# EAGLE design StackLightMonitor (EAGLE 8.1.0)
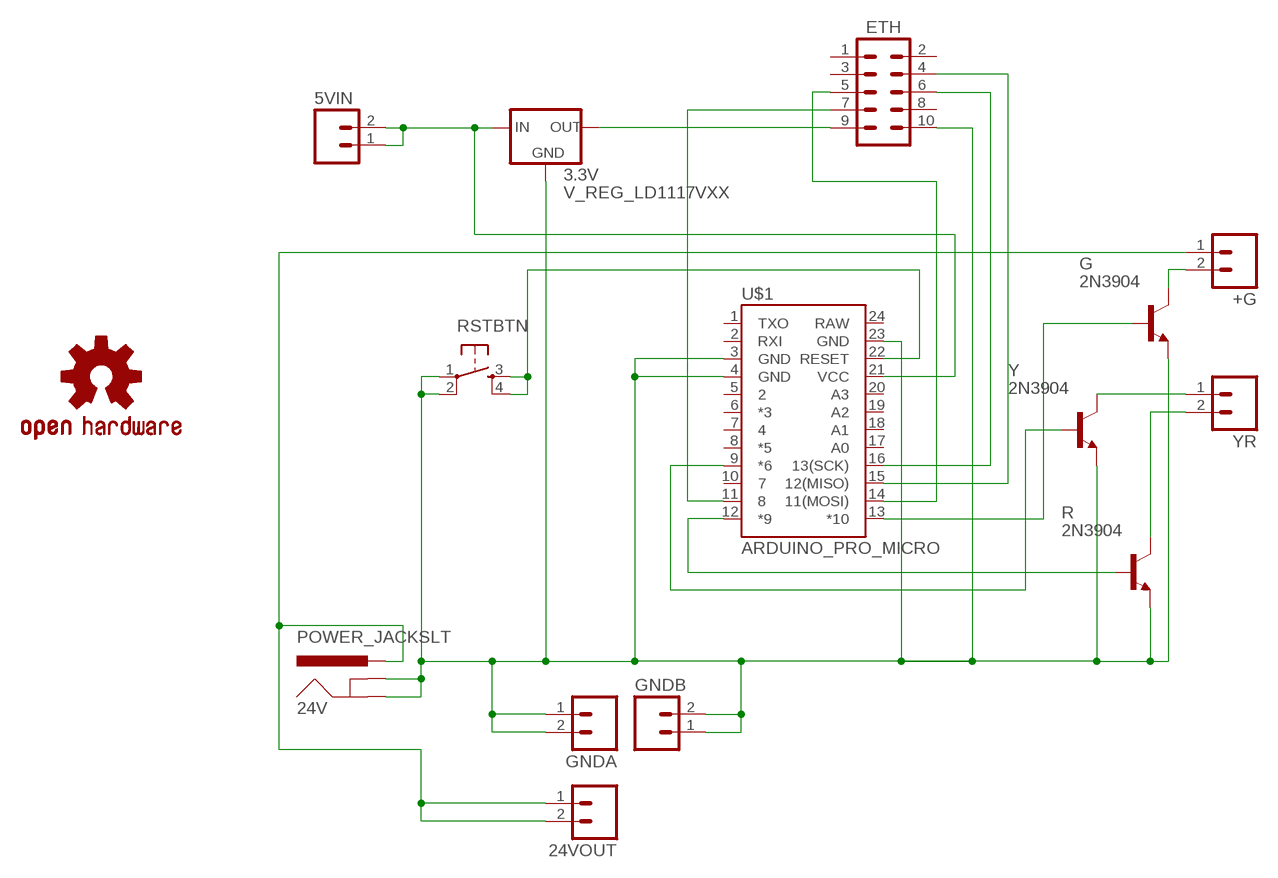
[diagram p0: schematic, sheet 1]

## Parts
3.3V  V_REG_LD1117VXX  [78XXL]
5VIN  M02PTH  [1X02]
24V  POWER_JACKSLT  [POWER_JACK_SLOT]
24VOUT  M02PTH  [1X02]
+G  M025MM  [SCREWTERMINAL-5MM-2]
ETH  M05X2PTH  [AVR_ICSP]
G  2N3904  [TO92]
GNDA  M02PTH  [1X02]
GNDB  M02PTH  [1X02]
LOGO1  OSHW-LOGOL  [OSHW-LOGO-L]
R  2N3904  [TO92]
RSTBTN  TAC_SWITCHPTH  [TACTILE-PTH]
U$1  ARDUINO_PRO_MICRO  [ARDUINO_PRO_MICRO]
Y  2N3904  [TO92]
YR  M025MM  [SCREWTERMINAL-5MM-2]

## Nets
5V: 3.3V.OUT(IN) 5VIN.1 5VIN.2 U$1.21(VCC)
24V: 24V.PWR 24VOUT.1 24VOUT.2 +G.1
33V: 3.3V.GND(OUT) ETH.9
CS: ETH.7 U$1.11
G: G.2(B) U$1.13(*10)
GGND: +G.2 G.1(C)
GND: 3.3V.IN(GND) 24V.GND@1(GNDBREAK) 24V.GND@2(GND) ETH.10 G.3(E) GNDA.1 GNDA.2 GNDB.1 GNDB.2 R.3(E) RSTBTN.1 RSTBTN.2 U$1.3(GND) U$1.4(GND) U$1.23(GND) Y.3(E)
MISO: ETH.4 U$1.15(12(MISO))
MOSI: ETH.5 U$1.14(11(MOSI))
R: R.2(B) U$1.12(*9)
RESET: RSTBTN.3 RSTBTN.4 U$1.22(RESET)
RGND: R.1(C) YR.2
SCK: ETH.6 U$1.16(13(SCK))
Y: U$1.9(*6) Y.2(B)
YGND: Y.1(C) YR.1
Unconnected: ETH.1 ETH.2 ETH.3 ETH.8 U$1.1(TXO) U$1.2(RXI) U$1.5 U$1.6(*3) U$1.7 U$1.8(*5) U$1.10 U$1.17(A0) U$1.18(A1) U$1.19(A2) U$1.20(A3) U$1.24(RAW)

## Library data of the parts
3.3V = SparkFun-PowerIC:V_REG_LD1117VXX: LD1117VXX voltage regulator. We carry the 3.3V version (COM-00526) in TO-220 package.
5VIN 24VOUT GNDA GNDB = SparkFun-Connectors:M02: Standard 2-pin 0.1" header. Use with - straight break away headers ( PRT-00116) - right angle break away headers (PRT-00553) - swiss pins (PRT-00743) - machine pins (PRT-00117) - female headers (PRT-00115) Molex polarized connector foot print use with: PRT-08233 with associated crimp pins and housings. 2.54_SCREWTERM for use with PRT-10571. 3.5mm Screw Terminal footprints for PRT-08084 5mm Screw Terminal footprints for use with PRT-08432
24V = SparkFun-Connectors:POWER_JACK: Power Jack This is the standard 5.5mm barrel jack for power. The PTH is the most common, proven, reliable, footprint. The Slot footprint only works if the mill layer is transmitted to the PCB fab house so be warned. Mating wall wart : TOL-00298 (and others); PROD_ID: PRT-00119
+G YR = SparkFun-Connectors:M02: Standard 2-pin 0.1" header. Use with - straight break away headers ( PRT-00116) - right angle break away headers (PRT-00553) - swiss pins (PRT-00743) - machine pins (PRT-00117) - female headers (PRT-00115) Molex polarized connector foot print use with: PRT-08233 with associated crimp pins and housings. 2.54_SCREWTERM for use with PRT-10571. 3.5mm Screw Terminal footprints for PRT-08084 5mm Screw Terminal footprints for use with PRT-08432; STOREFRONT_ID: PRT-08432
ETH = SparkFun-Connectors:M05X2: Header 5x2 Standard 10-pin dual row 0.1" header. Commonly used with AVR-ISP. Use with Spark Fun Electronics SKU: PRT-00778
G R Y = transistor:2N3904: NPN TRANSISTOR
LOGO1 = SparkFun-Aesthetics:OSHW-LOGO: Open-Source Hardware (OSHW) Logo This logo indicates the piece of hardware it is found on incorporates a OSHW license and/or adheres to the definition of open source hardware found here: http://freedomdefined.org/OSHW
RSTBTN = SparkFun-Retired:TAC_SWITCH: Momentary Switch Button commonly used for reset or general input. Spark Fun Electronics SKU : COM-00097 SMT- SWCH-08247
U$1 = SparkFun-Boards:ARDUINO_PRO_MICRO

## Board
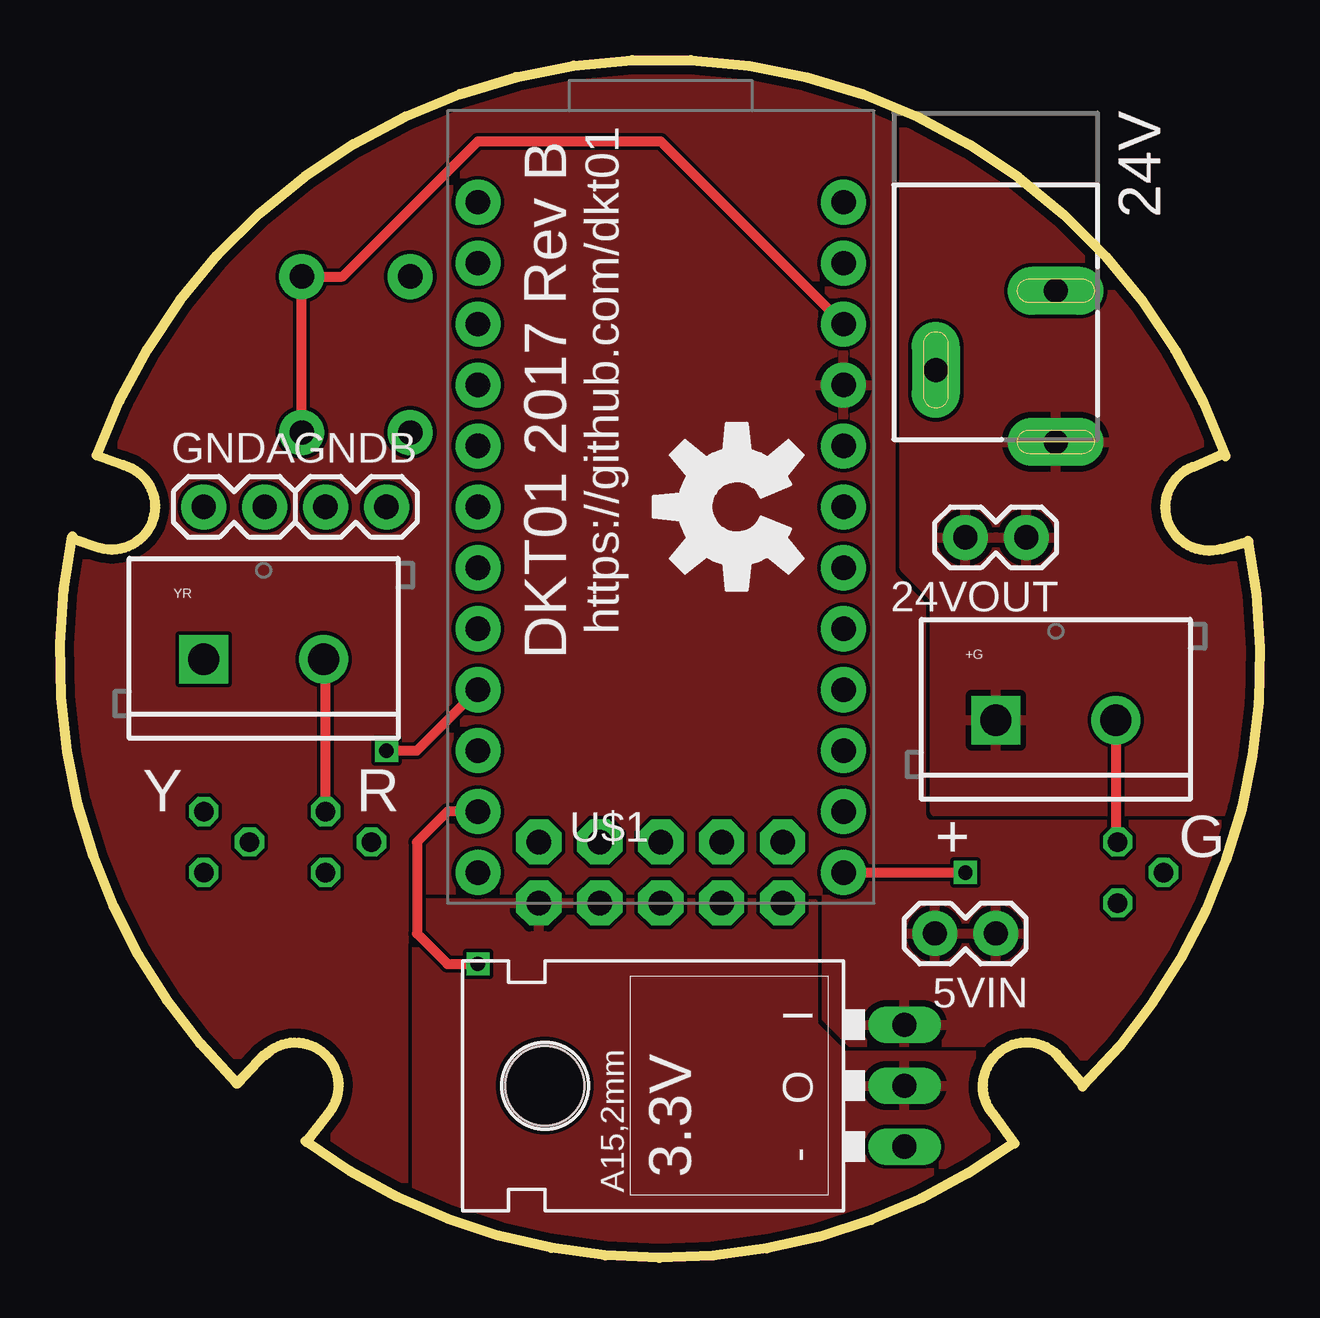
[diagram p1: board, top side]
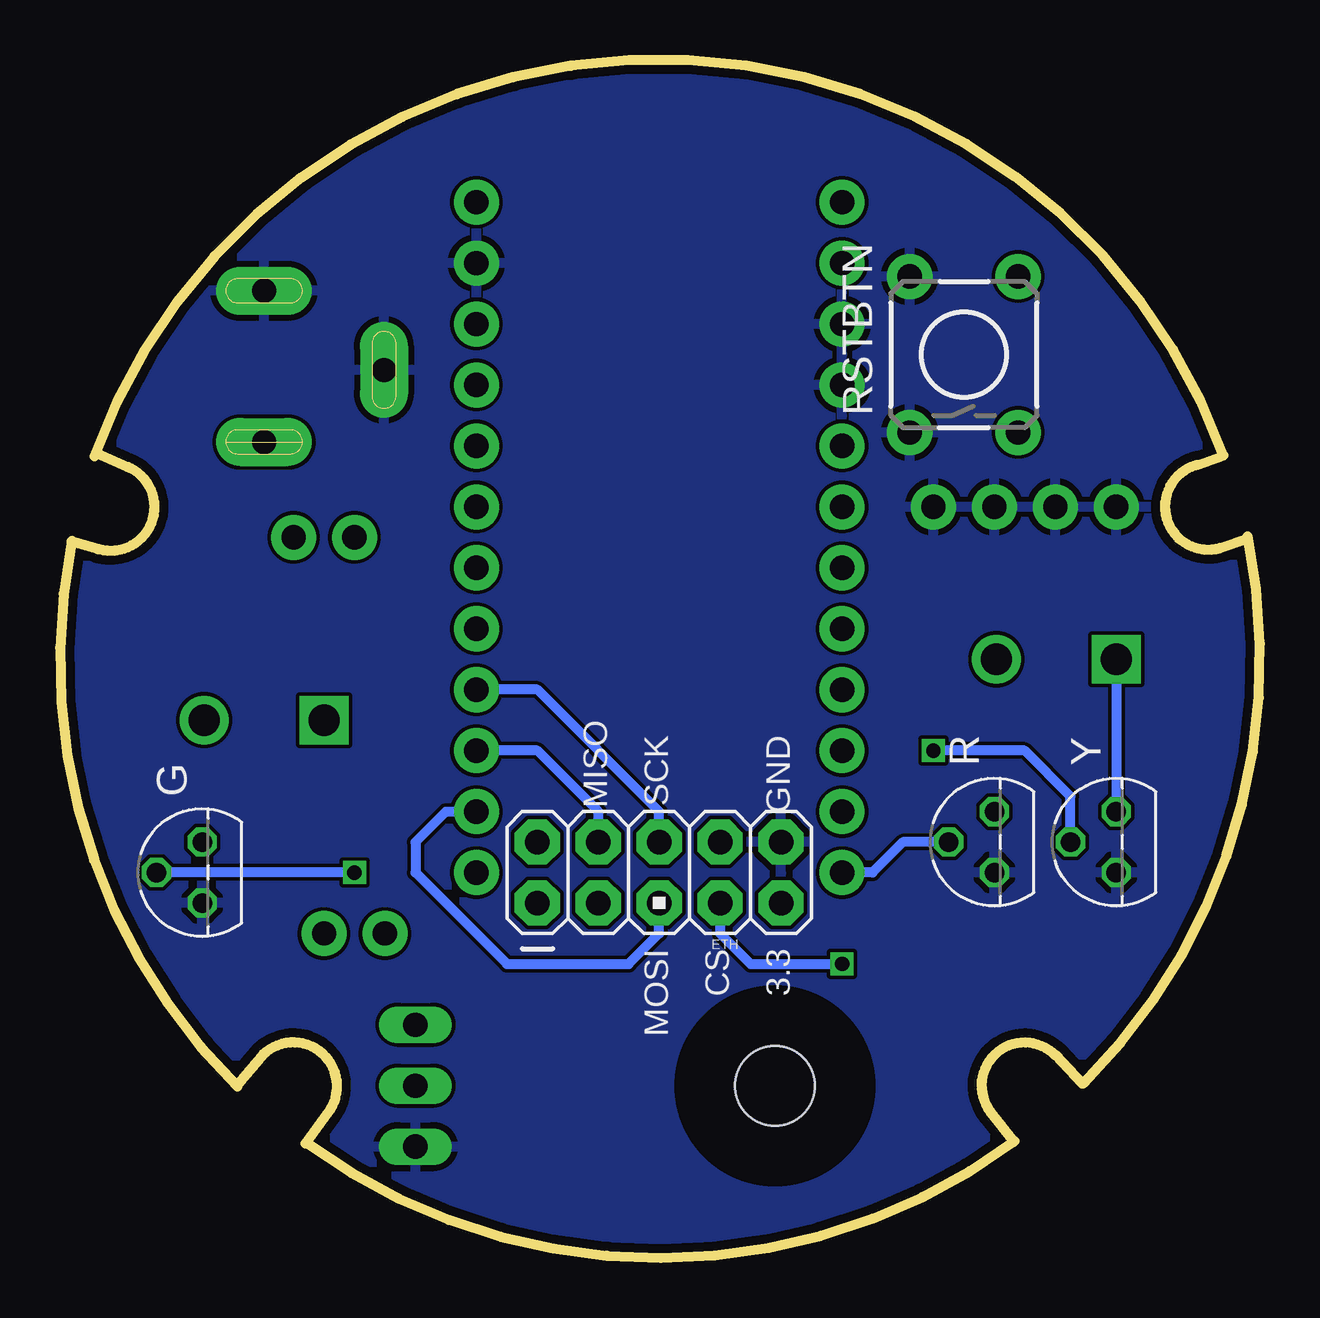
[diagram p2: board, bottom side, seen from below]

Size 50.02 x 49.93 mm. Coordinates in mm from the lower left corner, seen from the top.
Outline: 2.68,33.04 arc-180 1.65,29.6
Outline: 2.62,33.06 1.51,33.45
Outline: 1.65,29.6 0.54,29.96
Outline: 8.52,8.43 arc-174 11.22,6.07
Outline: 8.54,8.48 7.41,7.27
Outline: 11.23,6.06 10.26,4.84
Outline: 48.42,29.56 arc-175 47.22,32.98
Outline: 47.21,32.98 48.49,33.52
Outline: 48.43,29.55 49.53,29.87
Outline: 38.87,6.02 arc-173 41.57,8.47
Outline: 38.84,6.07 39.79,4.77
Outline: 41.52,8.5 42.6,7.25
Outline: 1.53,33.45 arc-140 48.59,33.41
Outline: 49.52,29.9 arc-57 42.62,7.15
Outline: 39.75,4.79 arc-72 10.23,4.87
Outline: 7.36,7.28 arc-57 0.52,30.09
Copper layers (1*16): Top 0.0356mm / dielectric 1.5011mm / Bottom 0.0356mm
Design rules "LaenPCBOrder": minimum track width 6mil, minimum drill 13mil, track to track 6mil, track to pad 6mil, pad to pad 6mil, via to via 6mil, smd to smd 6mil, copper to edge 15mil, drill to drill 6mil, minimum pad ring 7mil, minimum via ring 7mil, stop-mask expansion 3mil, vias tented up to drill 0mil, thermal gap 10mil

### Footprints (pad centres in the part's own frame; a part is rotated, then mirrored left to right if it is on the bottom)
78XXL = drill 1.016 long: GND 0,-3.81; IN -2.54,-3.81; OUT 2.54,-3.81 | hole 3.302: 0,11.176
1X02 = drill 1.016 pad 1.88: 1 0,0; 2 2.54,0
POWER_JACK_SLOT = drill 1 pad 2 long: GND@1 2.58,7.5; GND@2 7.58,10.8; PWR 2.58,13.8
SCREWTERMINAL-5MM-2 = drill 1.3 pad 2.032 square: 1 0,0 | drill 1.3 pad 2.032: 2 5,0
AVR_ICSP = drill 1.016 pad 1.88 octagon: 1 -1.27,5.08; 2 1.27,5.08; 3 -1.27,2.54; 4 1.27,2.54; 5 -1.27,0; 6 1.27,0; 7 -1.27,-2.54; 8 1.27,-2.54; 9 -1.27,-5.08; 10 1.27,-5.08
TO92 = drill 0.813 octagon: 1 1.27,0; 2 0,1.905; 3 -1.27,0
TACTILE-PTH = drill 1.016 pad 1.88: 1 -3.251,2.261; 2 3.251,2.261; 3 -3.251,-2.261; 4 3.251,-2.261
ARDUINO_PRO_MICRO = drill 1.016 pad 1.88: 1 -7.62,12.7; 2 -7.62,10.16; 3 -7.62,7.62; 4 -7.62,5.08; 5 -7.62,2.54; 6 -7.62,0; 7 -7.62,-2.54; 8 -7.62,-5.08; 9 -7.62,-7.62; 10 -7.62,-10.16; 11 -7.62,-12.7; 12 -7.62,-15.24; 13 7.62,-15.24; 14 7.62,-12.7; 15 7.62,-10.16; 16 7.62,-7.62; 17 7.62,-5.08; 18 7.62,-2.54; 19 7.62,0; 20 7.62,2.54; 21 7.62,5.08; 22 7.62,7.62; 23 7.62,10.16; 24 7.62,12.7

### Placement (x,y rotation side)
3.3V  31.39,7.18 90 top
5VIN  39.01,13.53 180 top
24V  44.09,47.82 180 top
24VOUT  40.28,30.04 180 top
+G  39.01,22.42 0 top
ETH  25.04,16.07 90 bottom
G  44.09,16.07 90 bottom
GNDA  5.99,31.31 0 top
GNDB  11.07,31.31 0 top
LOGO1  28.22,31.31 90 top
R  11.07,17.34 90 bottom
RSTBTN  12.34,37.66 90 bottom
U$1  25.04,31.31 0 top
Y  5.99,17.34 90 bottom
YR  5.99,24.96 0 top

### Tracks (layer width: path | path; a pad name or v marks a point on that pad's centre or on a via)
5V
  pour Top (rank 2): -0.36,-0.44 50.44,-0.44 50.44,49.09 50.44,50.36 -0.36,50.36
24V
  pour Top: 35.2,49.09 50.44,49.09 50.44,18.61 36.47,18.61 36.47,27.5 35.2,28.77
33V
  pour Top: 31.39,14.8 31.39,9.72 32.66,8.45 41.55,8.45 41.55,-0.44 14.88,-0.44 14.88,14.8
CS  (via drill 0.6)
  Top 0.406: U$1.11 16.15,18.61 14.88,17.34 14.88,13.53 16.15,12.26 v17.42,12.26
  Bottom 0.406: v17.42,12.26 21.23,12.26 22.5,13.53 ETH.7
G  (via drill 0.6)
  Top 0.406: U$1.13 v37.74,16.07
  Bottom 0.406: v37.74,16.07 G.2
GGND
  Top 0.406: +G.2 44.01,17.42 G.1
GND
  pour Bottom: -4.17,51.63 51.71,51.63 51.71,-1.71 -4.17,-1.71
MISO
  Bottom 0.406: ETH.4 27.58,18.61 30.12,21.15 U$1.15
MOSI
  Bottom 0.406: ETH.5 25.04,13.53 26.31,12.26 31.39,12.26 35.2,16.07 35.2,17.34 33.93,18.61 U$1.14
R
  Bottom 0.406: R.2 14.88,17.34 16.15,16.07 U$1.12
RESET
  Top 0.406: RSTBTN.3 RSTBTN.4 11.78,40.91 17.42,46.55 25.04,46.55 U$1.22
RGND
  Top 0.406: R.1 11.07,24.88 YR.2
SCK
  Bottom 0.406: ETH.6 25.04,18.61 30.12,23.69 U$1.16
Y  (via drill 0.6)
  Top 0.406: v13.61,21.15 14.88,21.15 U$1.9
  Bottom 0.406: Y.2 7.9,19.24 9.8,21.15 v13.61,21.15
YGND
  Bottom 0.406: YR.1 Y.1

### Text on the board
tPlace: https://github.com/dkt01 | DKT01 2017 Rev B | Y | R | + | G | I | O | -
bPlace: GND | SCK | MISO | 3.3 | CS | MOSI